# Altium project Movement_Circuit_V2.PrjPcb
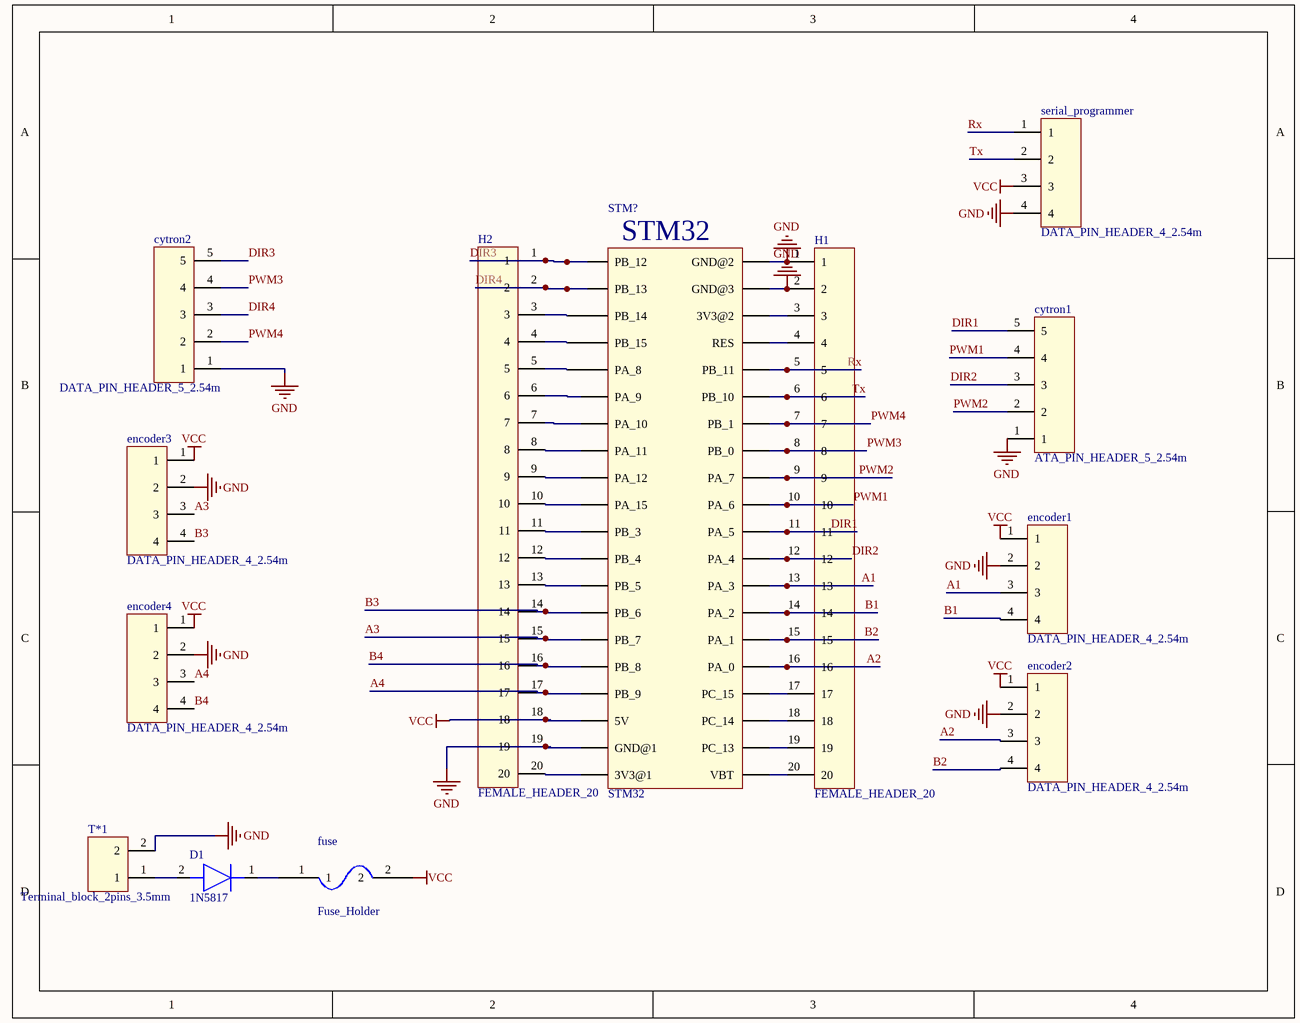
[diagram p0: Sheet1.SchDoc]
1 sheet, 13 parts. Net scope: global (net labels, ports and power ports of the same name join across sheets).
Board file: PCB1.PcbDoc

## Sheet Sheet1.SchDoc
size A; SheetNumber: 1; SheetTotal: 1

### Parts
cytron1  ATA_PIN_HEADER_5_2.54m  [DATA_PIN_HEADER_5_2.54m]
cytron2  DATA_PIN_HEADER_5_2.54m  [DATA_PIN_HEADER_5_2.54m]
D1  1N5817  [DIOAD1910W90L670D310]
encoder1  DATA_PIN_HEADER_4_2.54m  [DATA_PIN_HEADER_4_2.54m]
encoder2  DATA_PIN_HEADER_4_2.54m  [DATA_PIN_HEADER_4_2.54m]
encoder3  DATA_PIN_HEADER_4_2.54m  [DATA_PIN_HEADER_4_2.54m]
encoder4  DATA_PIN_HEADER_4_2.54m  [DATA_PIN_HEADER_4_2.54m]
fuse  Fuse_Holder  [Fuse_Holder]
H1  FEMALE_HEADER_20  [Female_Header_20]
H2  FEMALE_HEADER_20  [Female_Header_20]
serial_programmer  DATA_PIN_HEADER_4_2.54m  [DATA_PIN_HEADER_4_2.54m]
STM?  STM32  [STM32]
T*1  Terminal_block_2pins_3.5mm  [Terminal_block_2pins_3.5mm]

### Nets
GND: cytron1.1 cytron2.1 encoder1.2 encoder2.2 encoder3.2 encoder4.2 H1.1 H1.2 H2.19 serial_programmer.4 STM?.GND@1 STM?.GND@2 STM?.GND@3 T*1.2
VCC: encoder1.1 encoder2.1 encoder3.1 encoder4.1 fuse.2 H2.18 serial_programmer.3 STM?.5V
A1: encoder1.3 H1.13 STM?.PA_3
A2: encoder2.3 H1.16 STM?.PA_0
A3: encoder3.3 H2.15 STM?.PB_7
A4: encoder4.3 H2.17 STM?.PB_9
B1: encoder1.4 H1.14 STM?.PA_2
B2: encoder2.4 H1.15 STM?.PA_1
B3: encoder3.4 H2.14 STM?.PB_6
B4: encoder4.4 H2.16 STM?.PB_8
DIR1: cytron1.5 H1.11 STM?.PA_5
DIR2: cytron1.3 H1.12 STM?.PA_4
DIR3: cytron2.5 H2.1 STM?.PB_12
DIR4: cytron2.3 H2.2 STM?.PB_13
PWM1: cytron1.4 H1.10 STM?.PA_6
PWM2: cytron1.2 H1.9 STM?.PA_7
PWM3: cytron2.4 H1.8 STM?.PB_0
PWM4: cytron2.2 H1.7 STM?.PB_1
Rx: H1.5 serial_programmer.1 STM?.PB_11
Tx: H1.6 serial_programmer.2 STM?.PB_10
NetD1_1: D1.1(K) fuse.1
NetD1_2: D1.2(A) T*1.1
NetH1_3: H1.3 STM?.3V3@2
NetH1_4: H1.4 STM?.RES
NetH1_17: H1.17 STM?.PC_15
NetH1_18: H1.18 STM?.PC_14
NetH1_19: H1.19 STM?.PC_13
NetH1_20: H1.20 STM?.VBT
NetH2_3: H2.3 STM?.PB_14
NetH2_4: H2.4 STM?.PB_15
NetH2_5: H2.5 STM?.PA_8
NetH2_6: H2.6 STM?.PA_9
NetH2_7: H2.7 STM?.PA_10
NetH2_8: H2.8 STM?.PA_11
NetH2_9: H2.9 STM?.PA_12
NetH2_10: H2.10 STM?.PA_15
NetH2_11: H2.11 STM?.PB_3
NetH2_12: H2.12 STM?.PB_4
NetH2_13: H2.13 STM?.PB_5
NetH2_20: H2.20 STM?.3V3@1

### Library data of the parts
cytron1 = DATA_PIN_HEADER_5_2.54m
D1 = 1N5399: Diode; Manufacturer_Name: onsemi; Datasheet Link: https://www.mouser.com/datasheet/2/308/1n5399-1190225.pdf; Manufacturer_Part_Number: 1N5399; Mouser Part Number: 512-1N5399; Mouser Price/Stock: https://www.mouser.co.uk/ProductDetail/onsemi-Fairchild/1N5399?qs=PIXeunmp7KMUmqT%252BO5XHUg%3D%3D
fuse = Fuse_Holder: Fuse Base Holder T5x20
STM? = CMP-007-000000-1: Design Item ID: STM32; Source: MIA_LIBRARY.SchLib